# Altium schematic sheet Power_Supply.SchDoc: Main_Board_v2.2_Power_Supply
size A4
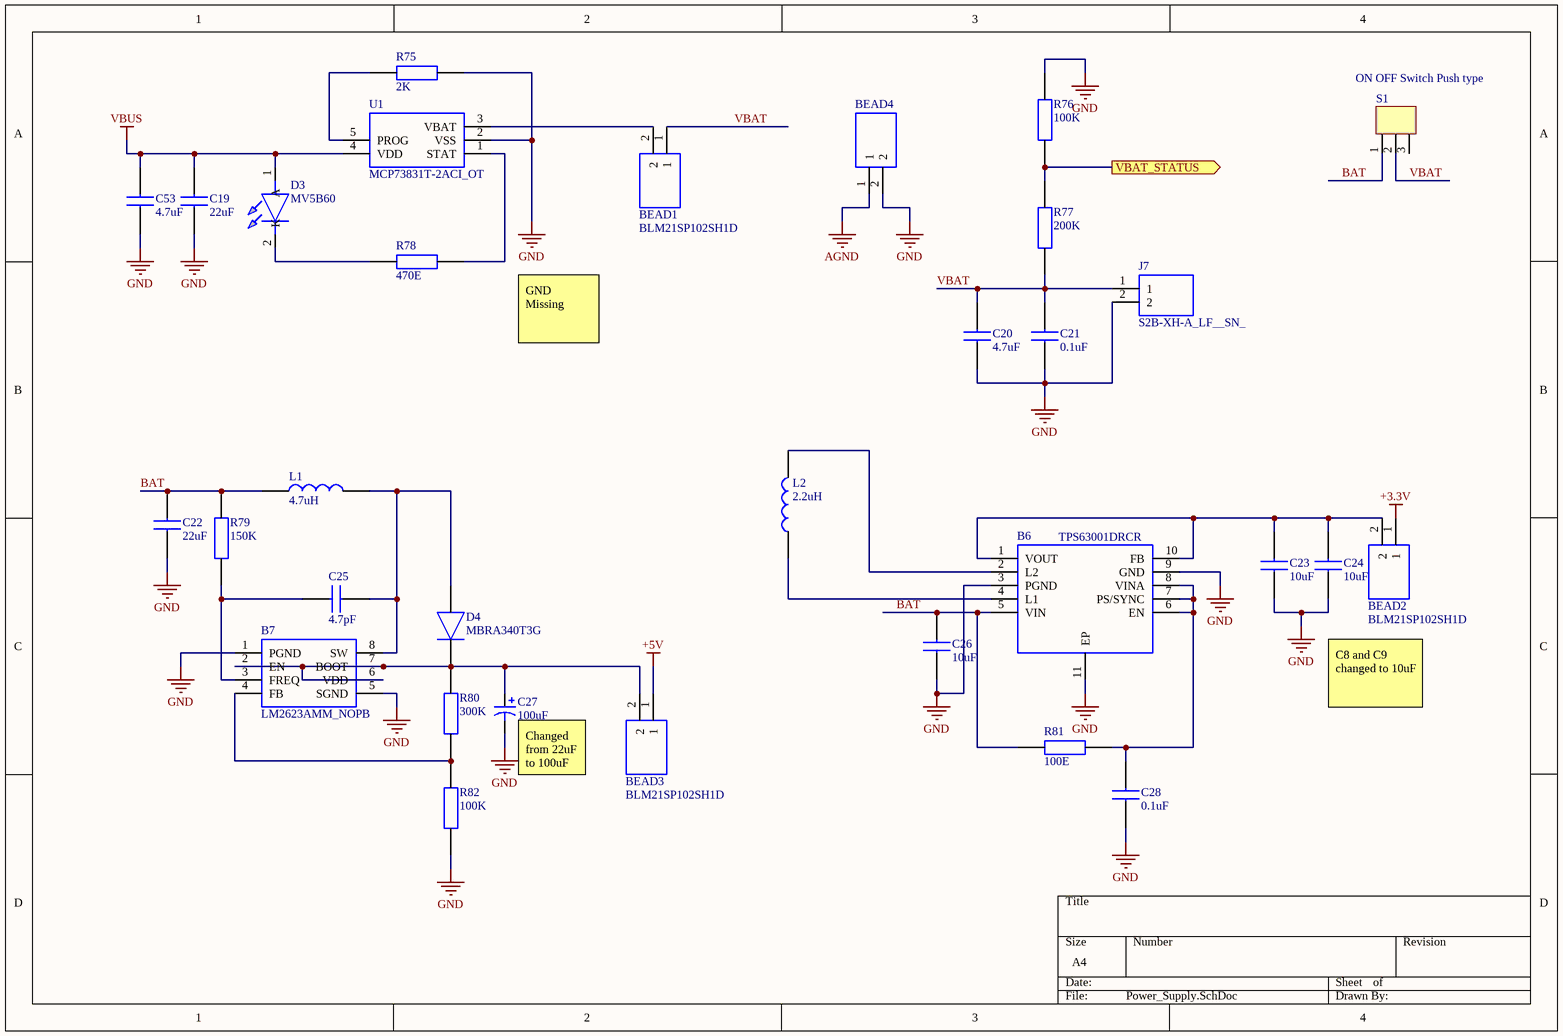
[diagram p0: Power_Supply.SchDoc]

## Parts
B6  TPS63001DRCR  [SON50P300X300X100-11N-D]
B7  LM2623AMM_NOPB  [SOP65P490X110-8N]
BEAD1  BLM21SP102SH1D  [Bead_0805]
BEAD2  BLM21SP102SH1D  [Bead_0805]
BEAD3  BLM21SP102SH1D  [Bead_0805]
BEAD4  BLM21SP102SH1D  [Bead_0805]  (value not drawn)
C19  22uF  [CAPC3216X180N]
C20  4.7uF  [CAPC2012X140N]
C21  0.1uF  [CAPC1005X55N]
C22  22uF  [CAPC3216X180N]
C23  10uF  [CAPC1608X80N]
C24  10uF  [CAPC1608X80N]
C25  4.7pF  [CAPC2012X88N]
C26  10uF  [CAPC3216X170N]
C27  value 100uF  [Tantalum Capacitor_2917]  (hidden comment: Cap Pol1)
C28  0.1uF  [CAPC1005X55N]
C53  4.7uF  [CAPC2012X140N]
D3  MV5B60  [MV5B60]
D4  MBRA340T3G  [DIOM5226X220N]
J7  S2B-XH-A_LF__SN_  [SHDRRA2W80P0X250_1X2_740X1150X610P]
L1  4.7uH  [INDC2012X140N]
L2  2.2uH  [INDC2012X140N]
R75  2K  [RESC1005X40N]
R76  100K  [RESC2012X60N]
R77  200K  [RESC2012X60N]
R78  470E  [RESC1005X40N]
R79  150K  [RESC2012X50N]
R80  300K  [RESC1005X40N]
R81  100E  [RESC1005X40N]
R82  100K  [RESC1005X40N]
S1  ON OFF Switch Push type  [SPST_Push type]
U1  MCP73831T-2ACI_OT  [SOT95P270X145-5N]

## Ports
VBAT_STATUS (out)

## Nets
+3.3V: BEAD2.1
+5V: BEAD3.1
AGND: BEAD4.1
GND: B6.3(PGND) B6.9(GND) B6.11(EP) B7.1(PGND) B7.5(SGND) BEAD4.2 C19.1 C20.1 C21.1 C22.1 C23.1 C24.1 C26.1 C27.2 C28.1 C53.1 J7.2 R75.2 R76.2 R82.1 U1.2(VSS)
VBUS: C19.2 C53.2 D3.1(A) U1.4(VDD)
BAT: B6.5(VIN) C22.2 C26.2 L1.1 R79.2 R81.2 S1.1
VBAT: BEAD1.1 C20.2 C21.2 J7.1 R77.1 S1.2
VBAT_STATUS: R76.1 R77.2 ; port VBAT_STATUS
NetB6_1: B6.1(VOUT) B6.10(FB) BEAD2.2 C23.2 C24.2
NetB6_2: B6.2(L2) L2.2
NetB6_4: B6.4(L1) L2.1
NetB6_6: B6.6(EN) B6.7(PS/SYNC) B6.8(VINA) C28.2 R81.1
NetB7_2: B7.2(EN) B7.6(VDD) B7.7(BOOT) BEAD3.2 C27.1 D4.1(K) R80.2
NetB7_3: B7.3(FREQ) C25.1 R79.1
NetB7_4: B7.4(FB) R80.1 R82.2
NetB7_8: B7.8(SW) C25.2 D4.2(A) L1.2
NetBEAD1_2: BEAD1.2 U1.3(VBAT)
NetD3_2: D3.2(K) R78.2
NetR75_1: R75.1 U1.5(PROG)
NetR78_1: R78.1 U1.1(STAT)

Not connected (* = marked no-connect by the designer): S1 3

## Notes on the sheet
- GND  Missing
- C8 and C9 changed to 10uF
- (near C27) Changed from 22uF to 100uF Tantulum cap

## Library data of the parts
B6 = TPS63001DRCR: 96% Buck-Boost Converter with 1.7A Current Switches, 3.3V fixed Output voltage in 3x3 QFN; Manufacturer_Name: Texas Instruments; Geometry.Height: 1mm; Manufacturer_Part_Number: TPS63001DRCR; Arrow Part Number: TPS63001DRCR; Arrow Price/Stock: https://www.arrow.com/en/products/tps63001drcr/texas-instruments; Mouser Part Number: 595-TPS63001DRCR; Mouser Price/Stock: https://www.mouser.co.uk/ProductDetail/Texas-Instruments/TPS63001DRCR?qs=QZuYiDxzHagn01UZf%2F%252B1Bw%3D%3D; Datasheet Link: http://www.ti.com/lit/gpn/tps63001
B7 = LM2623AMM_NOPB: General Purpose, Gated Oscillator Based, DC/DC Boost Converter; Manufacturer_Name: Texas Instruments; Manufacturer_Part_Number: LM2623AMM/NOPB; Geometry.Height: 1.1mm; Arrow Part Number: LM2623AMM/NOPB; Arrow Price/Stock: https://www.arrow.com/en/products/lm2623ammnopb/texas-instruments; Mouser Part Number: 926-LM2623AMM/NOPB; Mouser Price/Stock: https://www.mouser.co.uk/ProductDetail/Texas-Instruments/LM2623AMM-NOPB?qs=X1J7HmVL2ZHUXFRmS%252BHhFg%3D%3D; Datasheet Link: http://www.ti.com/lit/ds/symlink/lm2623.pdf
BEAD1-BEAD4 = BLM21SP102SH1D: BLM21_H1D Series EMI Suppression Filter 1000+/-25% at 100MHz 1.6A @85; Manufacturer_Name: Murata Electronics; Geometry.Height: 1.05mm; Manufacturer_Part_Number: BLM21SP102SH1D; Arrow Part Number: BLM21SP102SH1D; Arrow Price/Stock: https://www.arrow.com/en/products/blm21sp102sh1d/murata-manufacturing; Mouser Part Number: 81-BLM21SP102SH1D; Mouser Price/Stock: https://www.mouser.co.uk/ProductDetail/Murata-Electronics/BLM21SP102SH1D?qs=17u8i%2FzlE88gxwLak368hw%3D%3D; Datasheet Link: https://www.murata.com/en-us/products/productdetail?partno=BLM21SP102SH1%23
C19 C22 = CC1206KKX7R6BB226: Multilayer Ceramic Capacitors MLCC - SMD/SMT 22uF 10% 10V; Manufacturer_Name: YAGEO (PHYCOMP); Geometry.Height: 1.8mm; Manufacturer_Part_Number: CC1206KKX7R6BB226; Arrow Part Number: CC1206KKX7R6BB226; Arrow Price/Stock: *; Mouser Part Number: 603-CC206KKX7R6BB226; Mouser Price/Stock: https://www.mouser.com/Search/Refine.aspx?Keyword=603-CC206KKX7R6BB226; Datasheet Link: https://www.mouser.com/datasheet/2/447/UPY-GPHC_X7R_6.3V-to-50V_18-1154002.pdf
C20 C53 = C0805C475J9RACAUTO: KEMET 0805 (2012M) 4.7uF MLCC 6.3V dc +/-5% SMD C0805C475J9RACAUTO; Geometry.Height: 1.4mm; Manufacturer_Name: Kemet; Manufacturer_Part_Number: C0805C475J9RACAUTO; Arrow Part Number: C0805C475J9RACAUTO; Arrow Price/Stock: https://www.arrow.com/en/products/c0805c475j9racauto/kemet-corporation; Mouser Part Number: 80-C0805C475J9RAUTO; Mouser Price/Stock: https://www.mouser.com/Search/Refine.aspx?Keyword=80-C0805C475J9RAUTO; Datasheet Link: https://api.kemet.com/component-edge/download/datasheet/C0805C475J9RACAUTO.pdf
C21 C28 = C0402C104M4RECTU: Multilayer Ceramic Capacitors MLCC - SMD/SMT 16V 0.1uF X7R 0402 20%; Manufacturer_Name: Kemet; Geometry.Height: 0.55mm; Manufacturer_Part_Number: C0402C104M4RECTU; Arrow Part Number: C0402C104M4RECTU; Arrow Price/Stock: *; Mouser Part Number: 80-C0402C104M4RECTU; Mouser Price/Stock: https://www.mouser.com/Search/Refine.aspx?Keyword=80-C0402C104M4RECTU; Datasheet Link: https://content.kemet.com/datasheets/KEM_C1002_X7R_SMD.pdf
C23 = C0402C104M4RECTU: CAP TANT 10UF 10% 6.3V 1206; Manufacturer_Name: Kemet; Manufacturer_Part_Number: 293D106X96R3A2TE3; Geometry.Height: 0.55mm; Arrow Part Number: C0402C104M4RECTU; Arrow Price/Stock: *; Mouser Part Number: 80-C0402C104M4RECTU; Mouser Price/Stock: https://www.mouser.com/Search/Refine.aspx?Keyword=80-C0402C104M4RECTU; Datasheet Link: https://content.kemet.com/datasheets/KEM_C1002_X7R_SMD.pdf
C24 = CC1206KKX7R6BB226: CAP TANT 10UF 10% 6.3V 1206; Manufacturer_Name: YAGEO (PHYCOMP); Manufacturer_Part_Number: 293D106X96R3A2TE3; Geometry.Height: 1.8mm; Arrow Part Number: CC1206KKX7R6BB226; Arrow Price/Stock: *; Mouser Part Number: 603-CC206KKX7R6BB226; Mouser Price/Stock: https://www.mouser.com/Search/Refine.aspx?Keyword=603-CC206KKX7R6BB226; Datasheet Link: https://www.mouser.com/datasheet/2/447/UPY-GPHC_X7R_6.3V-to-50V_18-1154002.pdf
C25 = C0805C479C2GACTU: Kemet 0805 C 4.7pF Ceramic Multilayer Capacitor, 200 V dc, +125C, C0G Dielectric, +/-0.25pF; Geometry.Height: 0.88mm; Manufacturer_Name: Kemet; Manufacturer_Part_Number: C0805C479C2GACTU; Arrow Part Number: C0805C479C2GACTU; Arrow Price/Stock: *; Mouser Part Number: 80-C0805C479C2G; Mouser Price/Stock: https://www.mouser.co.uk/ProductDetail/KEMET/C0805C479C2GACTU?qs=Kt%252B%2Fw7aCTnl%2FOadhisFOJw%3D%3D; Datasheet Link: https://search.kemet.com/component-edge/download/specsheet/C0805C479C2GACTU.pdf
C26 = VJ1206G106KXXTW1BC: Multilayer Ceramic Capacitors MLCC - SMD/SMT 10uF 25volts 10%; Manufacturer_Name: Vishay; Geometry.Height: 1.7mm; Manufacturer_Part_Number: VJ1206G106KXXTW1BC; Arrow Part Number: VJ1206G106KXXTW1BC; Arrow Price/Stock: *; Mouser Part Number: 77-VJ126G106KXXTW1BC; Mouser Price/Stock: https://www.mouser.co.uk/ProductDetail/Vishay-Vitramon/VJ1206G106KXXTW1BC?qs=%252BqhDFMvZazSFJ5Hhl5VYQw%3D%3D; Datasheet Link: http://www.vishay.com/docs/45200/vjhirelseries.pdf
C27 = Cap Pol1: Polarized Capacitor (Radial); Published: 8-Jun-2000; LatestRevisionDate: 17-Jul-2002; LatestRevisionNote: Re-released for DXP Platform.; PackageReference: RB7.6-15; Publisher: Altium Limited; PackageDescription: Polarized Capacitor (Radial); 2 Leads
D3 = MV5B60: Standard LEDs - Through Hole T-100 BLUE CLEAR; Manufacturer_Name: Everlight; Manufacturer_Part_Number: MV5B60; Arrow Part Number: MV5B60; Arrow Price/Stock: *; Mouser Part Number: 638-MV5B60; Mouser Price/Stock: https://www.mouser.com/Search/Refine.aspx?Keyword=638-MV5B60; Datasheet Link: https://componentsearchengine.com/Datasheets/1/MV5B60.pdf
D4 = MBRA340T3G: MBRA340T3G, Schottky Diode,  3A max, 40V, 2-Pin, SMA; Manufacturer_Name: ON Semiconductor; Geometry.Height: 2.2mm; Manufacturer_Part_Number: MBRA340T3G; Arrow Part Number: MBRA340T3G; Arrow Price/Stock: https://www.arrow.com/en/products/mbra340t3g/on-semiconductor; Mouser Part Number: 863-MBRA340T3G; Mouser Price/Stock: https://www.mouser.co.uk/ProductDetail/ON-Semiconductor/MBRA340T3G?qs=3JMERSakebq0pjb145uRLw%3D%3D; Datasheet Link: http://www.onsemi.com/pub/Collateral/MBRA340T3-D.PDF
J7 = S2B-XH-A_LF__SN_: XH-2.5mm Header side entry 2 way JST XH Series, Series Number S2B, 2.5mm Pitch 2 Way 1 Row Right Angle PCB Header, Solder Termination, 3A; Manufacturer_Name: JST (JAPAN SOLDERLESS TERMINALS); Manufacturer_Part_Number: S2B-XH-A(LF)(SN); Geometry.Height: 6.1mm; Arrow Part Number: S2B-XH-A(LF)(SN); Arrow Price/Stock: https://www.arrow.com/en/products/s2b-xh-a-lf-sn/jst-manufacturing; Mouser Part Number: *; Mouser Price/Stock: *; Datasheet Link: http://www.jst-mfg.com/product/pdf/eng/eXH.pdf
L1 L2 = BRC2012T2R2MD: Manufacturer_Name: TAIYO YUDEN; Geometry.Height: 1.4mm; Manufacturer_Part_Number: BRC2012T2R2MD; Arrow Part Number: BRC2012T2R2MD; Arrow Price/Stock: http://www.arrow.com/en/products/brc2012t2r2md/taiyo-yuden; Mouser Part Number: 963-BRC2012T2R2MD; Mouser Price/Stock: https://www.mouser.co.uk/ProductDetail/Taiyo-Yuden/BRC2012T2R2MD?qs=I6KAKw0tg2xahQxcAJDRXw%3D%3D; Datasheet Link: https://www.mouser.com/datasheet/2/396/wound07_e-1628381.pdf
R75 = RC0402JR-072KL: RESISTOR, 0402 2K Ohms +/-5% 1/16 W; Manufacturer_Name: YAGEO (PHYCOMP); Geometry.Height: 0.4mm; Manufacturer_Part_Number: RC0402JR-072KL; Arrow Part Number: RC0402JR-072KL; Arrow Price/Stock: https://www.arrow.com/en/products/rc0402jr-072kl/yageo; Mouser Part Number: 603-RC0402JR-072KL; Mouser Price/Stock: https://www.mouser.com/Search/Refine.aspx?Keyword=603-RC0402JR-072KL; Datasheet Link: http://www.yageo.com/documents/recent/PYu-RC0402_51_RoHS_L_6_r.pdf
R76 = RC0805JR-072ML: Thick Film Resistors - SMD 2M OHM 5%; Manufacturer_Name: YAGEO (PHYCOMP); Geometry.Height: 0.6mm; Manufacturer_Part_Number: RC0805JR-072ML; Arrow Part Number: RC0805JR-072ML; Arrow Price/Stock: https://www.arrow.com/en/products/rc0805jr-072ml/yageo; Mouser Part Number: 603-RC0805JR-072ML; Mouser Price/Stock: https://www.mouser.com/Search/Refine.aspx?Keyword=603-RC0805JR-072ML; Datasheet Link: http://www.yageo.com/documents/recent/PYu-RC_Group_51_RoHS_L_10.pdf
R77 = RC0805FR-07806KL: Thick Film Resistors - SMD 806K OHM 1%; Manufacturer_Name: YAGEO (PHYCOMP); Geometry.Height: 0.6mm; Manufacturer_Part_Number: RC0805FR-07806KL; Arrow Part Number: RC0805FR-07806KL; Arrow Price/Stock: https://www.arrow.com/en/products/rc0805fr-07806kl/yageo; Mouser Part Number: 603-RC0805FR-07806KL; Mouser Price/Stock: https://www.mouser.com/Search/Refine.aspx?Keyword=603-RC0805FR-07806KL; Datasheet Link: http://www.yageo.com/documents/recent/PYu-RC_Group_51_RoHS_L_10.pdf
R78 = RC0402JR-13470RL: Thick Film Resistors - SMD 470 ohm 5% 50V General Purpose; Manufacturer_Name: YAGEO (PHYCOMP); Geometry.Height: 0.4mm; Manufacturer_Part_Number: RC0402JR-13470RL; Arrow Part Number: RC0402JR-13470RL; Arrow Price/Stock: https://www.arrow.com/en/products/rc0402jr-13470rl/yageo; Mouser Part Number: 603-RC0402JR-13470RL; Mouser Price/Stock: https://www.mouser.co.uk/ProductDetail/Yageo/RC0402JR-13470RL?qs=fPU49sp6fCK89krzeMh7Zw%3D%3D; Datasheet Link: http://www.yageo.com/documents/recent/PYu-RC0402_51_RoHS_L_6_r.pdf
R79 = CRCW0805150KDKTA: Thick Film Resistors - SMD 1/8watt 150Kohms .5%; Manufacturer_Name: Vishay; Geometry.Height: 0.5mm; Manufacturer_Part_Number: CRCW0805150KDKTA; Arrow Part Number: CRCW0805150KDKTA; Arrow Price/Stock: *; Mouser Part Number: 71-CRCW08051503DT; Mouser Price/Stock: *; Datasheet Link: http://www.vishay.com/docs/20035/dcrcwe3.pdf
R80 = RC0402JR-07300KL: Thick Film Resistors - SMD 300K Ohm 5% 1/16W 50 Volts; Manufacturer_Name: YAGEO (PHYCOMP); Geometry.Height: 0.4mm; Manufacturer_Part_Number: RC0402JR-07300KL; Arrow Part Number: RC0402JR-07300KL; Arrow Price/Stock: *; Mouser Part Number: 603-RC0402JR-07300KL; Mouser Price/Stock: https://www.mouser.com/Search/Refine.aspx?Keyword=603-RC0402JR-07300KL; Datasheet Link: http://www.yageo.com/documents/recent/PYu-RC0402_51_RoHS_L_6_r.pdf
R81 = RC0402FR-07100RL: YAGEO (PHYCOMP) - RC0402FR-07100RL - RES, THICK FILM, 100R, 1%, 0.0625W, 0402; Geometry.Height: 0.4mm; Manufacturer_Name: YAGEO (PHYCOMP); Manufacturer_Part_Number: RC0402FR-07100RL; Arrow Part Number: RC0402FR-07100RL; Arrow Price/Stock: https://www.arrow.com/en/products/rc0402fr-07100rl/yageo; Mouser Part Number: 603-RC0402FR-07100RL; Mouser Price/Stock: https://www.mouser.co.uk/ProductDetail/Yageo/RC0402FR-07100RL?qs=V1yeUXFNrknwaJOOZ4yDtg%3D%3D; Datasheet Link: http://www.yageo.com/documents/recent/PYu-RC0402_51_RoHS_L_6_r.pdf
R82 = RCG0402100KFKED: Thick Film Resistors - SMD .063watt 100kohms 1% 0402 100ppm; Manufacturer_Name: Vishay; Geometry.Height: 0.4mm; Manufacturer_Part_Number: RCG0402100KFKED; Arrow Part Number: RCG0402100KFKED; Arrow Price/Stock: *; Mouser Part Number: 71-RCG0402100KFKED; Mouser Price/Stock: https://www.mouser.com/Search/Refine.aspx?Keyword=71-RCG0402100KFKED; Datasheet Link: http://www.vishay.com/docs/20037/rcae3.pdf
S1 = ON OFF Switch Push type: Part Number: PN12SHNA03QE
U1 = MCP73831T-2ACI_OT: Li-Ion Charge Controller 4.2V SOT23-5; Manufacturer_Name: Microchip; Manufacturer_Part_Number: MCP73831T-2ACI/OT; Geometry.Height: 1.45mm; Arrow Part Number: MCP73831T-2ACI/OT; Arrow Price/Stock: https://www.arrow.com/en/products/mcp73831t-2aciot/microchip-technology; Mouser Part Number: 579-MCP73831T-2ACIOT; Mouser Price/Stock: https://www.mouser.co.uk/ProductDetail/Microchip-Technology/MCP73831T-2ACI-OT?qs=yUQqVecv4qvbBQBGbHx0Mw%3D%3D; Datasheet Link: http://ww1.microchip.com/downloads/en/DeviceDoc/20001984g.pdf